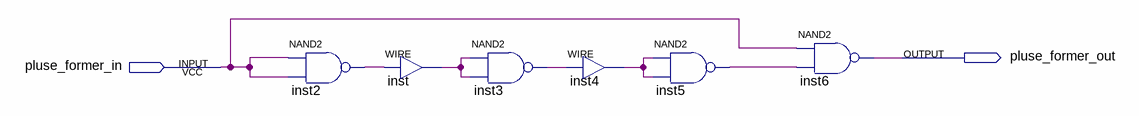
[diagram p0: schematic sheet]
// Quartus schematic pluse_former.bdf as structural Verilog: 6 symbols, 2 pins
module pluse_former (
  input  pluse_former_in,
  output pluse_former_out
);

  wire inst2_out, inst3_out, inst4_out, inst5_out, inst_out;

  nand inst2 (inst2_out, pluse_former_in, pluse_former_in);
  assign inst_out = inst2_out;  // WIRE inst
  nand inst3 (inst3_out, inst_out, inst_out);
  assign inst4_out = inst3_out;  // WIRE inst4
  nand inst5 (inst5_out, inst4_out, inst4_out);
  nand inst6 (pluse_former_out, pluse_former_in, inst5_out);
endmodule
